# Altium schematic sheet Display.SchDoc: SR4K_PHY6222_LED
size A4; Revision: V1.2; SheetNumber: 3; SheetTotal: 5
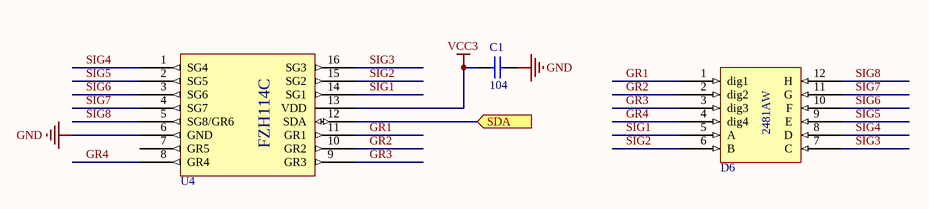
[diagram p0: Display.SchDoc]

## Parts
C1  value 104  (hidden comment: Cap)
D6  D*  (value not drawn)
U4  FZ114  (value not drawn)

## Ports
SDA (in)

## Nets
GND: C1.2 U4.6(GND)
VCC3: C1.1 U4.13(VDD)
GR1: D6.1(dig1) U4.11(GR1)
GR2: D6.2(dig2) U4.10(GR2)
GR3: D6.3(dig3) U4.9(GR3)
GR4: D6.4(dig4) U4.8(GR4)
SDA: U4.12(SDA) ; port SDA
SIG1: D6.5(A) U4.14(SG1)
SIG2: D6.6(B) U4.15(SG2)
SIG3: D6.7(C) U4.16(SG3)
SIG4: D6.8(D) U4.1(SG4)
SIG5: D6.9(E) U4.2(SG5)
SIG6: D6.10(F) U4.3(SG6)
SIG7: D6.11(G) U4.4(SG7)
SIG8: D6.12(H) U4.5(SG8/GR6)

Not connected (* = marked no-connect by the designer): U4 7(GR5)

## Notes on the sheet
- Title
- Size:
- Date:
- A4
- Number:
- Time:
- Revision:
- Sheet
- emmovo@outlook.com
- of
- File:
- (in symbol FZ114) FZH114C

## Library data of the parts
C1 = Cap: Capacitor; Published: 8-Jun-2000; LatestRevisionDate: 17-Jul-2002; LatestRevisionNote: Re-released for DXP Platform.; PackageReference: RAD-0.3; Publisher: Altium Limited; PackageDescription: Radial Cap, Thru-Hole; 2 Leads; 0.3 in Pin Spacing
D6 = 2481AW